# EAGLE design Door_switch (EAGLE 7.2.0)
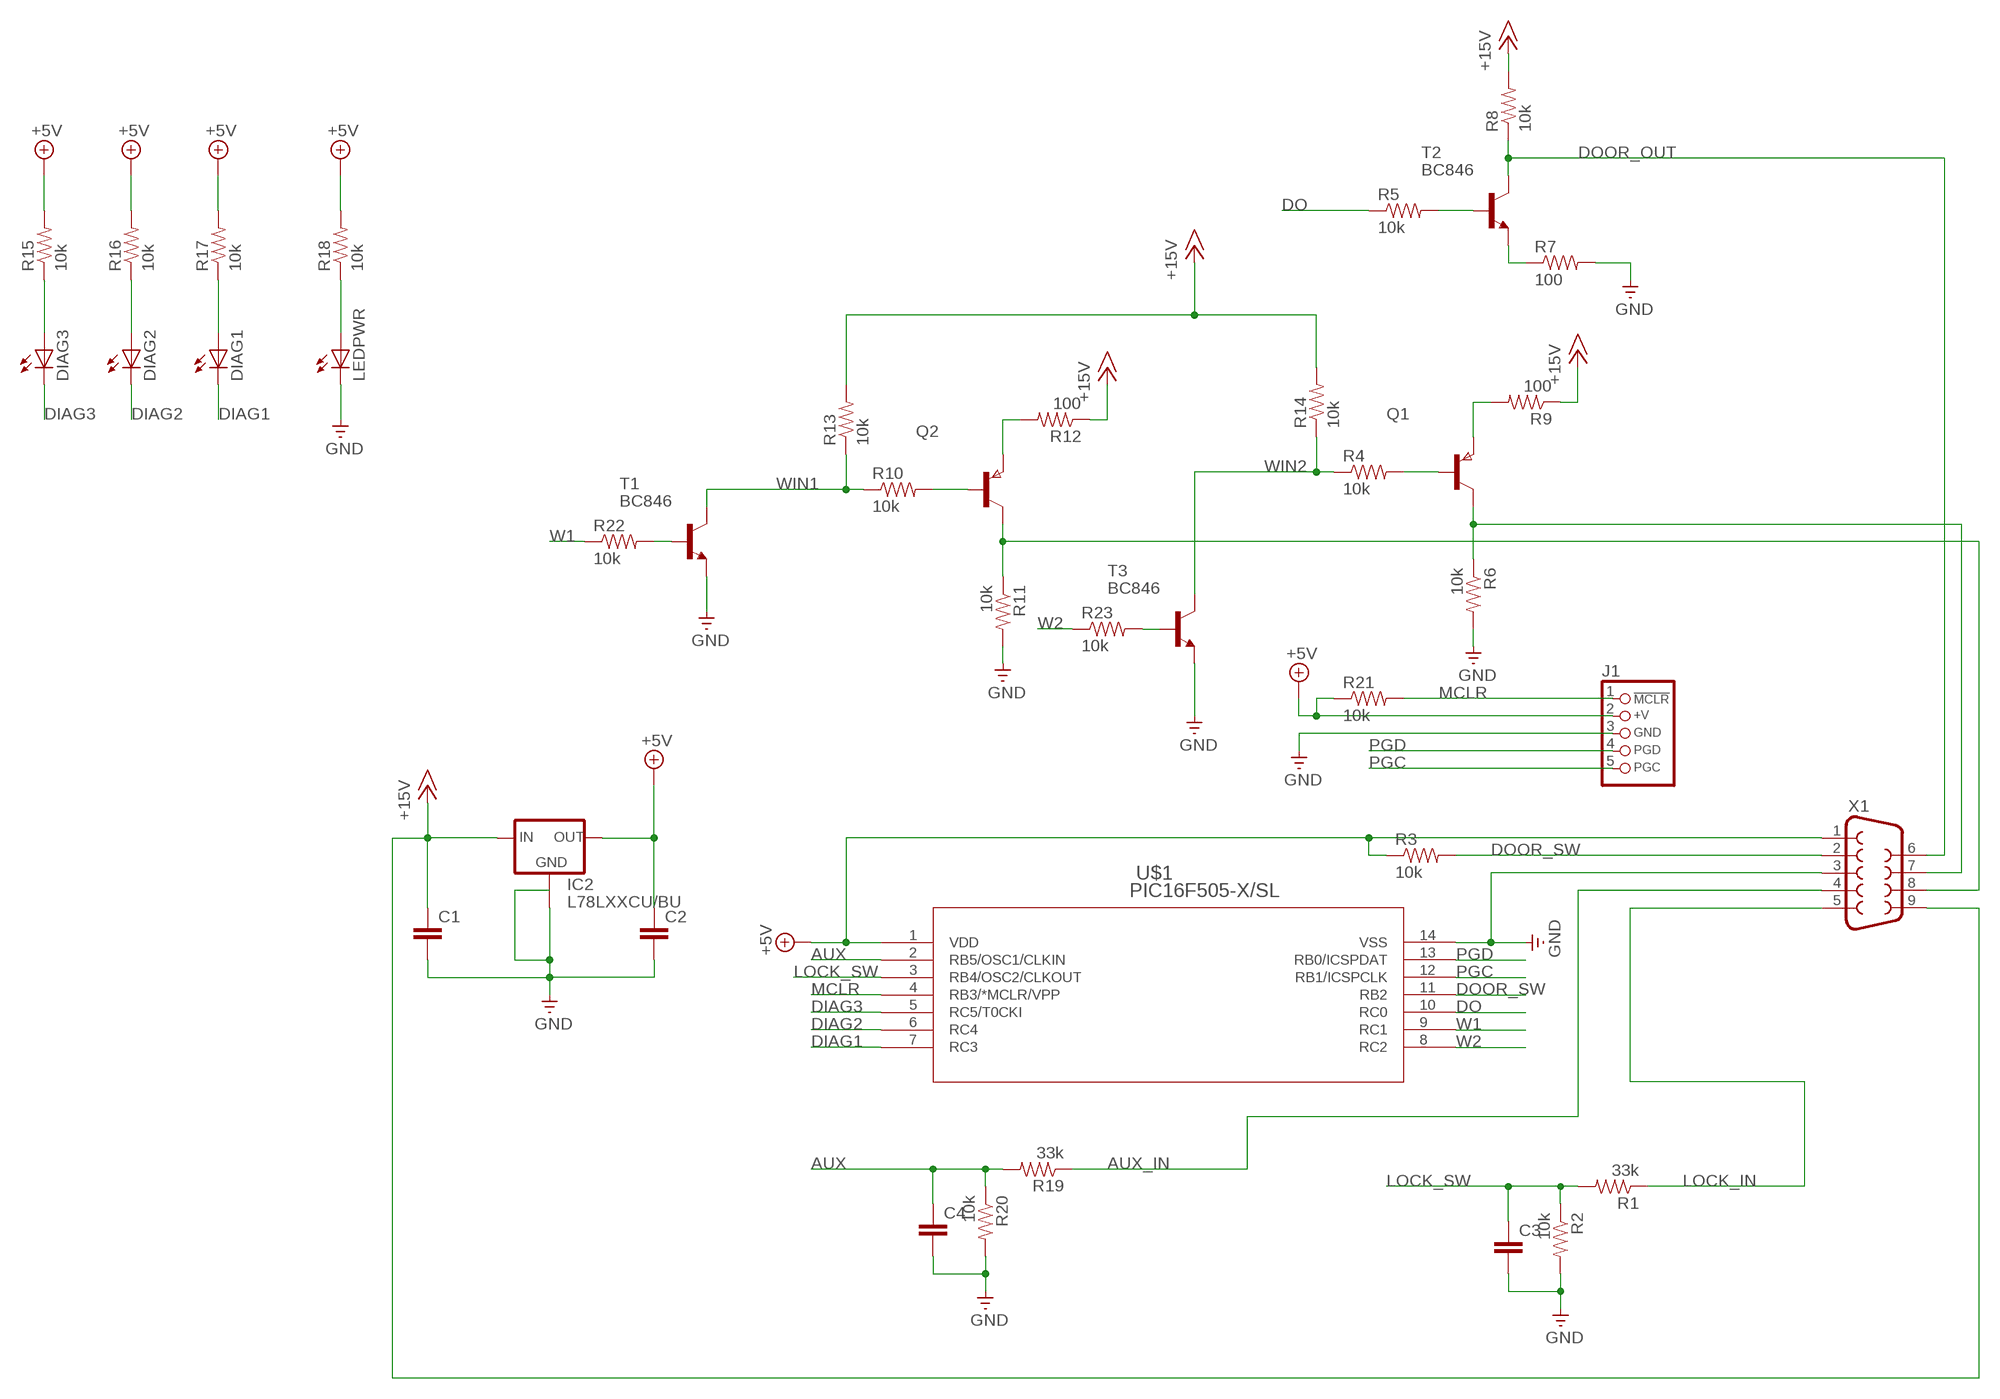
[diagram p0: schematic, sheet 1]

## Parts
C1  CC1206  [C1206]
C2  CC1206  [C1206]
C3  CC1206  [C1206]
C4  CC1206  [C1206]
DIAG1  LEDCHIP-LED0603  [CHIP-LED0603]
DIAG2  LEDCHIP-LED0603  [CHIP-LED0603]
DIAG3  LEDCHIP-LED0603  [CHIP-LED0603]
IC2  L78LXXCU/BU  [SOT89]
J1  CON_HEADER_PRG_PIC_ICSPA  [HEADER_PRG_1X05]
LEDPWR  LEDCHIP-LED0603  [CHIP-LED0603]
Q1  PNPSOT23  [SOT-23]
Q2  PNPSOT23  [SOT-23]
R1  33k  RESISTOR0603-RES  [0603-RES]
R2  10k  RESISTOR0603-RES  [0603-RES]
R3  10k  RESISTOR0603-RES  [0603-RES]
R4  10k  RESISTOR0603-RES  [0603-RES]
R5  10k  RESISTOR0603-RES  [0603-RES]
R6  10k  RESISTOR0603-RES  [0603-RES]
R7  100  RESISTOR0603-RES  [0603-RES]
R8  10k  RESISTOR0603-RES  [0603-RES]
R9  100  RESISTOR0603-RES  [0603-RES]
R10  10k  RESISTOR0603-RES  [0603-RES]
R11  10k  RESISTOR0603-RES  [0603-RES]
R12  100  RESISTOR0603-RES  [0603-RES]
R13  10k  RESISTOR0603-RES  [0603-RES]
R14  10k  RESISTOR0603-RES  [0603-RES]
R15  10k  RESISTOR0603-RES  [0603-RES]
R16  10k  RESISTOR0603-RES  [0603-RES]
R17  10k  RESISTOR0603-RES  [0603-RES]
R18  10k  RESISTOR0603-RES  [0603-RES]
R19  33k  RESISTOR0603-RES  [0603-RES]
R20  10k  RESISTOR0603-RES  [0603-RES]
R21  10k  RESISTOR0603-RES  [0603-RES]
R22  10k  RESISTOR0603-RES  [0603-RES]
R23  10k  RESISTOR0603-RES  [0603-RES]
T1  BC846  [SOT23]
T2  BC846  [SOT23]
T3  BC846  [SOT23]
U$1  PIC16F505-X/SL  [SOIC14-N_MC]
X1  F09HP  [F09HP]

## Nets
+5V: C2.1 IC2.1(OUT) J1.2(+V) R3.1 R15.2 R16.2 R17.2 R18.2 R21.1 U$1.1(VDD) X1.1
+15V: C1.1 IC2.3(IN) R8.2 R9.1 R12.1 R13.2 R14.2 X1.9
AUX: C4.1 R19.2 R20.1 U$1.2(RB5/OSC1/CLKIN)
AUX_IN: R19.1 X1.4
DIAG1: DIAG1.C U$1.7(RC3)
DIAG2: DIAG2.C U$1.6(RC4)
DIAG3: DIAG3.C U$1.5(RC5/T0CKI)
DO: R5.1 U$1.10(RC0)
DOOR_OUT: R8.1 T2.3(C) X1.6
DOOR_SW: R3.2 U$1.11(RB2) X1.2
GND: C1.2 C2.2 C3.2 C4.2 IC2.2(GND) IC2.4(GND1) J1.3(GND) LEDPWR.C R2.2 R6.2 R7.2 R11.2 R20.2 T1.2(E) T3.2(E) U$1.14(VSS) X1.3
LOCK_IN: R1.1 X1.5
LOCK_SW: C3.1 R1.2 R2.1 U$1.3(RB4/OSC2/CLKOUT)
MCLR: J1.1(/MCLR) R21.2 U$1.4(RB3/*MCLR/VPP)
N$2: Q2.3(B) R10.2
N$3: Q2.1(C) R11.1 X1.8
N$4: R7.1 T2.2(E)
N$5: R5.2 T2.1(B)
N$6: Q2.2(E) R12.2
N$7: DIAG3.A R15.1
N$8: DIAG2.A R16.1
N$9: Q1.3(B) R4.2
N$10: Q1.1(C) R6.1 X1.7
N$11: Q1.2(E) R9.2
N$12: DIAG1.A R17.1
N$13: LEDPWR.A R18.1
N$15: R22.2 T1.1(B)
N$16: R23.2 T3.1(B)
PGC: J1.5(PGC) U$1.12(RB1/ICSPCLK)
PGD: J1.4(PGD) U$1.13(RB0/ICSPDAT)
W1: R22.1 U$1.9(RC1)
W2: R23.1 U$1.8(RC2)
WIN1: R10.1 R13.1 T1.3(C)
WIN2: R4.1 R14.1 T3.3(C)

## Library data of the parts
C1-C4 = eagle-ltspice:C: CAPACITOR, European symbol; SPICEMODEL: NONE; SPICEPREFIX: C
DIAG1-DIAG3 LEDPWR = adafruit:LED: LED OSRAM: - CHIPLED LG R971, LG N971, LY N971, LG Q971, LY Q971, LO R971, LY R971 LH N974, LH R974 LS Q976, LO Q976, LY Q976 LO Q996 - Hyper CHIPLED LW Q18S LB Q993, LB Q99A, LB R99A - SideLED LS A670, LO A670, LY A670, LG A670, LP A670 LB A673, LV A673, LT A673, LW A673 LH A674 LY A675 LS A676, LA A676, LO A676, LY A676, LW A676 LS A679, LY A679, LG A679 - Hyper Micro SIDELED® LS Y876, LA Y876, LO Y876, LY Y876 LT Y87S - SmartLED LW L88C, LW L88S LB L89C, LB L89S, LG L890 LS L89K, LO L89K, LY L89K LS L896, LA L896, LO L896, LY L896 - TOPLED LS T670, LO T670, LY T670, LG T670, LP T670 LSG T670, LSP T670, LSY T670, LOP T670, LYG T670 LG T671, LOG T671, LSG T671 LB T673, LV T673, LT T673, LW T673 LH T674 LS T676, LA T676, LO T676, LY T676, LB T676, LH T676, LSB T676, LW T676 LB T67C, LV T67C, LT T67C, LS T67K, LO T67K, LY T67K, LW E67C LS E67B, LA E67B, LO E67B, LY E67B, LB E67C, LV E67C, LT E67C LW T67C LS T679, LY T679, LG T679 LS T770, LO T770, LY T770, LG T770, LP T770 LB T773, LV T773, LT T773, LW T773 LH T774 LS E675, LA E675, LY E675, LS T675 LS T776, LA T776, LO T776, LY T776, LB T776 LHGB T686 LT T68C, LB T68C - Hyper Mini TOPLED® LB M676 - Mini TOPLED Santana® LG M470 LS M47K, LO M47K, LY M47K Source: http://www.osram.convergy.de/
IC2 = v-reg-2:L78LXXCU/BU: VOLTAGE REGULATOR
J1 = dp_devices:CON_HEADER_PRG_PIC_ICSP: 5-pin PIC In Circuit Serial Programming header
Q1 Q2 = zetex:PNPSOT23: PNP TRANSISTOR; MPN: DSS20200L-7; OC_FARNELL: unknown; OC_NEWARK: 25R4554
R1-R23 = SparkFun:RESISTOR: Resistor Basic schematic elements and footprints for 0603, 1206, and PTH 1/10th watt (small) resistors.
T1-T3 = transistor:BC846: NPN TRANSISTOR
U$1 = PIC16F505_SOIC:PIC16F505-X/SL
X1 = con-subd:F09: SUB-D; OC_FARNELL: unknown; OC_NEWARK: unknown

## Board
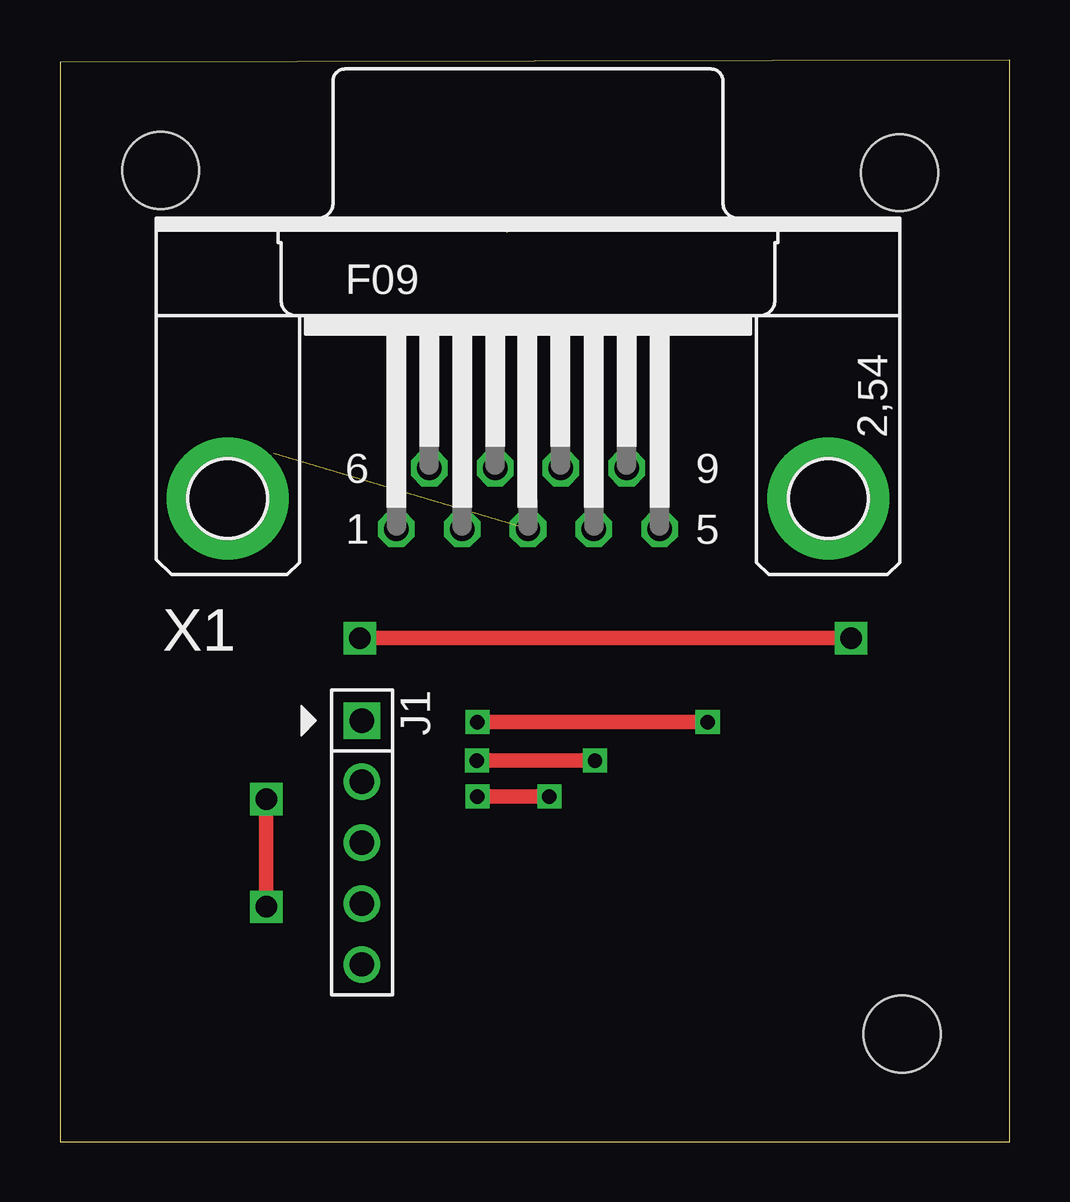
[diagram p1: board, top side]
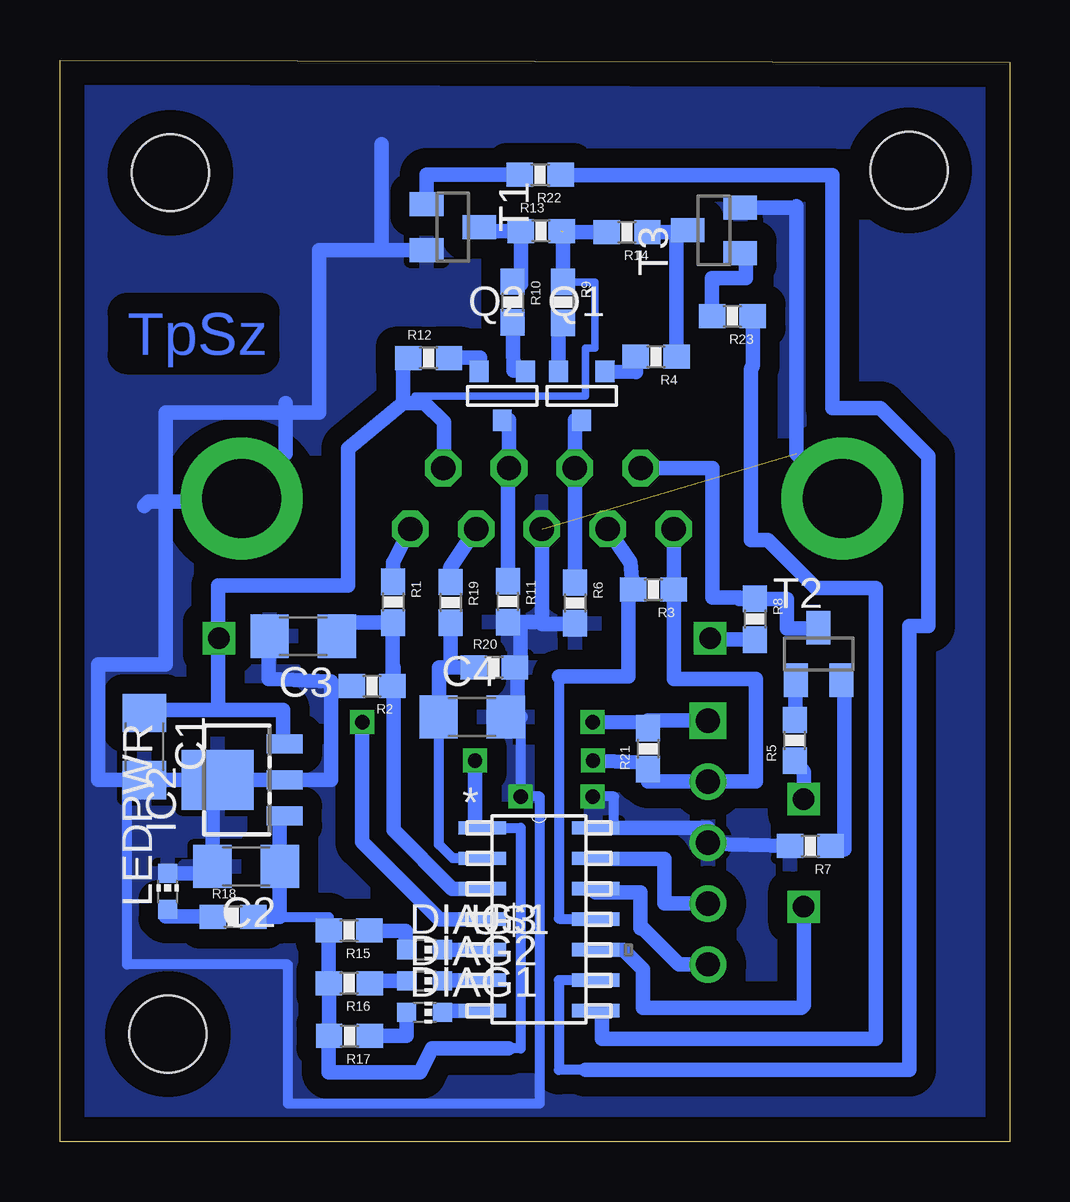
[diagram p2: board, bottom side, seen from below]

Size 39.6 x 45.1 mm. Coordinates in mm from the lower left corner, seen from the top.
Outline: 0,0 39.6,0 39.6,45.1 0,45 0,0
Copper layers (1*16): Top 0.035mm / dielectric 1.5mm / Bottom 0.035mm
Design rules "default": minimum track width 10mil, minimum drill 24mil, track to track 8mil, track to pad 8mil, pad to pad 8mil, via to via 8mil, smd to smd 8mil, copper to edge 40mil, drill to drill 8mil, minimum pad ring 10mil, minimum via ring 8mil, stop-mask expansion 4mil, vias tented up to drill 0mil, thermal gap 10mil
Holes 3.2 mm at 4.2,40.5 35,40.4 35.1,4.5

### Footprints (pad centres in the part's own frame; a part is rotated, then mirrored left to right if it is on the bottom)
C1206 = smd 1.6 x 1.8: 1 -1.4,0; 2 1.4,0
CHIP-LED0603 = smd 0.8 x 0.8: A 0,-0.75; C 0,0.75
SOT89 = smd 0.8 x 1.5: 1 -1.5,-1.75; 2 0,-1.75; 3 1.5,-1.75 | smd 2.5 x 3: 4 0,1.05
HEADER_PRG_1X05 = drill 1.016 square: 1 -5.08,0 | drill 1.016: 2 -2.54,0; 3 0,0; 4 2.54,0; 5 5.08,0
SOT-23 = smd 0.787 x 0.889: 1 0.025,-1.016; 2 -0.94,1.016; 3 0.991,1.016
0603-RES = smd 1.1 x 1: 1 -0.85,0; 2 0.85,0
SOT23 = smd 1 x 1.4: 1 -0.95,-1.1; 2 0.95,-1.1; 3 0,1.1
SOIC14-N_MC = smd 1.981 x 0.559: 1 -2.362,3.81; 2 -2.362,2.54; 3 -2.362,1.27; 4 -2.362,0; 5 -2.362,-1.27; 6 -2.362,-2.54; 7 -2.362,-3.81; 8 2.362,-3.81; 9 2.362,-2.54; 10 2.362,-1.27; 11 2.362,0; 12 2.362,1.27; 13 2.362,2.54; 14 2.362,3.81
F09HP = drill 1.016 octagon: 1 -5.486,-1.27; 2 -2.743,-1.27; 3 0,-1.27; 4 2.743,-1.27; 5 5.486,-1.27; 6 -4.115,1.27; 7 -1.372,1.27; 8 1.372,1.27; 9 4.115,1.27 | drill 3.302 pad 5.08: G1 -12.522,0; G2 12.522,0

### Placement (x,y rotation side)
C1  36.08,16.48 270 bottom
C2  31.84,11.48 180 bottom
C3  29.46,21.08 180 bottom
C4  22.42,17.72 0 bottom
DIAG1  24.4,5.4 270 bottom
DIAG2  24.4,6.71 270 bottom
DIAG3  24.4,8.02 270 bottom
IC2  31.98,15.09 90 bottom
J1  12.59,12.48 270 top
LEDPWR  35.11,10.44 0 bottom
Q1  17.88,31.1 0 bottom
Q2  21.19,31.1 0 bottom
R1  25.71,22.5 270 bottom
R2  26.59,19.01 180 bottom
R3  14.86,23.03 180 bottom
R4  14.75,32.73 180 bottom
R5  8.97,16.74 90 bottom
R6  18.13,22.47 270 bottom
R7  8.32,12.33 180 bottom
R8  10.63,21.79 270 bottom
R9  18.63,35 270 bottom
R10  20.73,35.01 270 bottom
R11  20.93,22.52 270 bottom
R12  24.23,32.67 0 bottom
R13  19.54,37.97 0 bottom
R14  15.96,37.92 180 bottom
R15  27.55,8.82 180 bottom
R16  27.54,6.62 180 bottom
R17  27.53,4.42 180 bottom
R18  32.38,9.38 0 bottom
R19  23.32,22.49 270 bottom
R20  21.5,19.78 0 bottom
R21  15.08,16.39 90 bottom
R22  19.58,40.32 180 bottom
R23  11.57,34.42 180 bottom
T1  23.22,38.13 270 bottom
T2  7.98,20.34 0 bottom
T3  12.34,38 90 bottom
U$1  19.63,9.28 0 bottom
X1  19.51,26.82 0 top

### Tracks (layer width: path | path; a pad name or v marks a point on that pad's centre or on a via)
+5V  (via drill 0.6)
  Top 0.61: v22.3,15.9 v17.38,15.9
  Bottom 0.406: 30.44,9.38 28.4,9.38 R15.2 | 22.3,13.09 U$1.1 20.4,13.09 20.4,3.9 20.9,3.9
  Bottom 0.61: X1.1 R3.1 14.01,19.3 10.6,19.3 10.6,15.02 J1.2 15.08,15.02 R21.1 15.08,15.8 v17.38,15.9 | IC2.1 30.44,13.59 C2.1 30.44,9.38 R18.2 | 28.36,8.82 R15.2 R16.2 R17.2 28.4,4.4 28.4,2.9 24.6,2.9 24.1,3.9 20.9,3.9 | 22.3,13.09 v22.3,15.9
+15V  (via drill 0.9)  (1 unrouted)
  Top 0.61: v12.5,21 v32.98,21
  Bottom 0.305: R9.1 17.3,35.85 17.3,33.1 17.7,33.1 17.7,31.1 24.8,31.1 24.8,30.8
  Bottom 0.61: IC2.3 30.3,16.59 30.3,18 33,18 | 33,18 36.08,18 C1.1 | X1.9 23.6,28.09 23.6,30 24.4,30.8 24.8,30.8 25.3,30.8 | R14.2 18.63,37.92 R9.1 | R8.2 12.5,20.94 v12.5,21 | R12.1 25.3,32.67 25.3,30.8 | 25.3,30.8 27.6,28.9 27.6,23.2 33,23.2 33,21 | 33,21 33,18 | v32.98,21 33,21
AUX
  Bottom 0.406: U$1.2 23.22,11.82 23.8,12.4 23.8,17.7 C4.1
  Bottom 0.61: R20.1 23.32,19.78 | 23.32,19.78 R19.2 | 23.32,19.78 23.8,19.78 23.8,17.8 23.82,17.8 C4.1
AUX_IN
  Bottom 0.61: X1.4 23.35,23.92 R19.1
DIAG1
  Bottom 0.61: U$1.7 23.65,5.47 DIAG1.C
DIAG2
  Bottom 0.61: U$1.6 23.65,6.74 DIAG2.C
DIAG3
  Bottom 0.61: U$1.5 DIAG3.C
DO  (via drill 0.9)
  Top 0.61: v8.6,14.29 v8.6,9.8
  Bottom 0.61: U$1.10 16.11,8.01 15.3,7.2 15.3,5.6 8.7,5.6 8.6,5.7 v8.6,9.8 | v8.6,14.29 8.6,15.42 R5.1
DOOR_OUT
  Bottom 0.61: X1.6 12.4,28.09 12.4,22.7 11.27,22.7 R8.1 | 11.27,22.64 R8.1 | R8.1 9.3,22.64 9.3,21.4 7.98,21.4 T2.3
DOOR_SW
  Bottom 0.406: 18.8,19.4 18.8,9.3 17.27,9.3
  Bottom 0.61: X1.2 15.81,24.15 R3.2 15.9,23.03 15.9,19.4 18.8,19.4 | 17.27,9.3 U$1.11
GND  (via drill 0.6)  (1 unrouted)
  Top 0.61: v17.4,14.4 v20.4,14.4
  Bottom 0.406: 20.4,17.72 v20.4,14.4 19.6,14.4 19.6,1.6 30.1,1.6 30.1,7.4 36.8,7.4 36.8,15.4 | 17.3,13.09 16.5,13.09 16.5,14.4 v17.4,14.4
  Bottom 0.61: IC2.4 C1.2 | IC2.4 IC2.2 28.3,15.09 28.3,19.2 | IC2.4 33.24,15.09 C2.2 33.24,11.19 LEDPWR.C | C3.2 30.9,20.58 30.9,19.3 28.3,19.2 | 28.3,19.2 28.24,18.8 R2.2 | X1.3 19.5,21.67 | R6.2 18.13,21.6 19.5,21.6 19.5,21.67 | R11.2 20.4,21.67 | 20.4,21.67 19.5,21.67 | 20.4,21.67 20.4,19.78 20.52,19.78 | R20.2 20.52,19.78 | R7.2 12.59,12.43 J1.3 12.59,13.09 U$1.14 17.3,13.09 | 20.52,19.78 20.52,17.7 C4.2 20.4,17.72 | 36.5,14.66 C1.2 | 36.08,15 C1.2 | T1.2 26.2,37.18 | 26.2,37.18 28.8,37.18 28.8,30.4 35.2,30.4 35.2,19.9 38,19.9 38,15.1 36.08,15.1 C1.2 | 11.2,38.95 T3.2 8.95,38.95 8.9,39 8.9,28.7 7,26.8 | 26.2,41.6 26.2,37.18 | 36.1,26.5 35.9,26.7 33.9,26.7 | 30.2,28.7 30.2,30.8
  pour Bottom (isolate 0.813): 0.3,44 38.8,44 39,0.6 0.5,0.6 0.3,43.8
LOCK_IN
  Bottom 0.61: X1.5 25.71,24.15 R1.1
LOCK_SW
  Bottom 0.61: C3.1 28.06,21.65 R1.2 25.74,21.65 R2.1 25.7,19.77 25.7,13 23.25,10.55 U$1.3
MCLR  (via drill 0.6)
  Top 0.61: v17.4,17.5 v27,17.5
  Bottom 0.61: J1.1 15.08,17.56 R21.2 15.08,17.48 v17.4,17.5 | U$1.4 23.78,9.28 27,12.5 v27,17.5
N$2
  Bottom 0.61: R10.2 20.7,32.16 Q2.3
N$3
  Bottom 0.61: Q2.1 20.88,30.08 X1.8 20.93,28.09 R11.1
N$4
  Bottom 0.61: T2.2 6.9,19.24 6.9,12.2 7.47,12.2 R7.1
N$5
  Bottom 0.61: R5.2 8.93,18.89 T2.1
N$6
  Bottom 0.61: Q2.2 22.1,32.12 22.1,32.7 23.38,32.7 R12.2
N$7
  Bottom 0.61: DIAG3.A 25.2,8.02 25.2,8.8 26.7,8.8 R15.1
N$8
  Bottom 0.61: DIAG2.A 26.69,6.71 R16.1
N$9
  Bottom 0.61: Q1.3 15.6,32.1 R4.2
N$10
  Bottom 0.61: Q1.1 18.14,30.08 X1.7 R6.1
N$11
  Bottom 0.61: R9.2 18.82,34.15 Q1.2
N$12
  Bottom 0.61: R17.1 25.15,4.42 DIAG1.A
N$13
  Bottom 0.61: LEDPWR.A 35.2,9.69 35.2,9.4 33.23,9.4 R18.1
N$15
  Bottom 0.61: T1.1 24.32,40.32 R22.2
N$16
  Bottom 0.61: T3.1 11,37.05 11,36 12.42,36 R23.2
PGC
  Bottom 0.406: 15.4,8.9 15.3,8.9
  Bottom 0.61: U$1.12 17.27,10.4 15.4,10.4 15.4,8.9 | J1.5 13.8,7.4 15.3,8.9
PGD
  Bottom 0.61: J1.4 14.4,9.94 14.4,11.8 17.27,11.8 U$1.13
W1
  Bottom 0.406: U$1.9 18.8,6.74 18.8,3 17.7,3
  Bottom 0.61: 18.73,40.3 R22.1 18.71,40.3 7.4,40.3 7.4,30.6 5.4,30.6 3.4,28.6 3.4,21.5 4.2,21.5 4.2,3 17.7,3
W2
  Bottom 0.61: U$1.8 17,5.47 17,4.3 5.6,4.3 5.6,23.1 8.1,23.1 10.1,25.1 10.8,25.1 10.8,32.2 10.72,32.38 R23.1
WIN1
  Bottom 0.61: R10.1 20.39,35.76 R13.1 22.12,37.97 T1.3
WIN2
  Bottom 0.61: R14.1 13.9,37.92 | T3.3 13.14,37.92 13.9,37.92 | 13.9,37.92 R4.1

### Text on the board
Bottom: TpSz